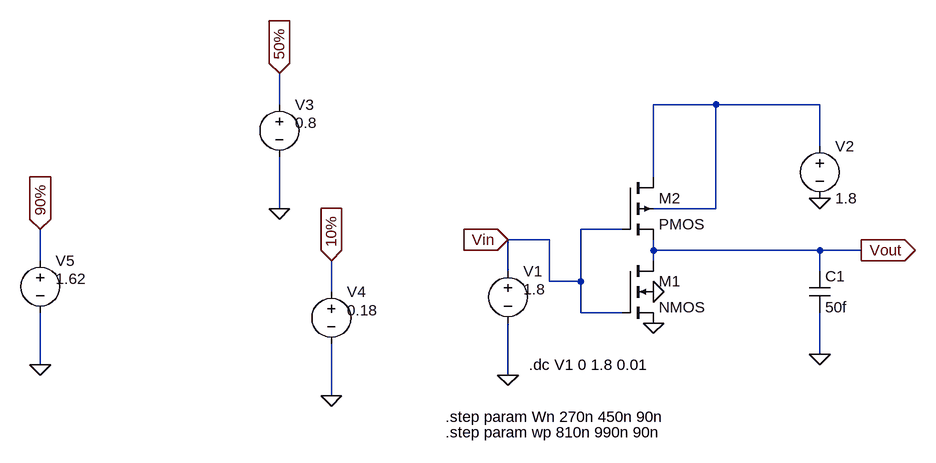
[diagram p0: schematic 180_parm_change_inverter - VTC.asc]
180_parm_change_inverter - VTC.asc, the LTspice schematic file:
Version 4.1
SHEET 1 880 680
WIRE -400 -80 -400 -128
WIRE 272 -80 176 -80
WIRE 432 -80 272 -80
WIRE 432 -16 432 -80
WIRE 176 32 176 -80
WIRE -400 80 -400 0
WIRE 272 80 272 -80
WIRE 272 80 176 80
WIRE 128 112 64 112
WIRE 16 128 -48 128
WIRE 176 144 176 128
WIRE 432 144 176 144
WIRE 496 144 432 144
WIRE -768 160 -768 112
WIRE 176 160 176 144
WIRE -48 176 -48 128
WIRE 432 176 432 144
WIRE 16 192 16 128
WIRE 64 192 64 112
WIRE 64 192 16 192
WIRE -320 208 -320 160
WIRE 64 240 64 192
WIRE 128 240 64 240
WIRE 432 304 432 240
WIRE -768 320 -768 240
WIRE -48 336 -48 256
WIRE -320 368 -320 288
FLAG -48 336 0
FLAG 432 64 0
FLAG 176 256 0
FLAG 176 208 0
FLAG 432 304 0
FLAG -48 128 Vin
IOPIN -48 128 In
FLAG 496 144 Vout
IOPIN 496 144 Out
FLAG -400 80 0
FLAG -400 -128 50%
IOPIN -400 -128 In
FLAG -320 368 0
FLAG -320 160 10%
IOPIN -320 160 In
FLAG -768 320 0
FLAG -768 112 90%
IOPIN -768 112 In
SYMBOL nmos4 128 160 R0
SYMATTR InstName M1
SYMATTR Value2 l=180nm w=Wn
SYMBOL pmos4 128 32 R0
SYMATTR InstName M2
SYMATTR Value2 l=180nm w=Wp
SYMBOL cap 416 176 R0
SYMATTR InstName C1
SYMATTR Value 50f
SYMBOL voltage -48 160 R0
WINDOW 123 0 0 Left 0
WINDOW 39 0 0 Left 0
WINDOW 3 24 44 Left 2
SYMATTR Value 1.8
SYMATTR InstName V1
SYMBOL voltage 432 -32 R0
WINDOW 123 0 0 Left 0
WINDOW 39 0 0 Left 0
SYMATTR InstName V2
SYMATTR Value 1.8
SYMBOL voltage -400 -96 R0
WINDOW 123 0 0 Left 0
WINDOW 39 0 0 Left 0
WINDOW 3 24 44 Left 2
SYMATTR Value 0.8
SYMATTR InstName V3
SYMBOL voltage -320 192 R0
WINDOW 123 0 0 Left 0
WINDOW 39 0 0 Left 0
WINDOW 3 24 44 Left 2
SYMATTR Value 0.18
SYMATTR InstName V4
SYMBOL voltage -768 144 R0
WINDOW 123 0 0 Left 0
WINDOW 39 0 0 Left 0
WINDOW 3 24 44 Left 2
SYMATTR Value 1.62
SYMATTR InstName V5
TEXT -144 400 Left 2 !.step param Wn 270n 450n 90n
TEXT -144 424 Left 2 !.step param wp 810n 990n 90n
TEXT -16 320 Left 2 !.dc V1 0 1.8 0.01

The netlist it stands for:
* 180_parm_change_inverter - VTC.asc
M1 Vout Vin 0 0 NMOS l=180nm w=Wn
M2 N001 Vin Vout N001 PMOS l=180nm w=Wp
C1 Vout 0 50f
V1 Vin 0 1.8
V2 N001 0 1.8
V3 50% 0 0.8
V4 10% 0 0.18
V5 90% 0 1.62
.model NMOS NMOS
.model PMOS PMOS
.lib standard.mos
.step param Wn 270n 450n 90n
.step param wp 810n 990n 90n
.dc V1 0 1.8 0.01
.backanno
.end